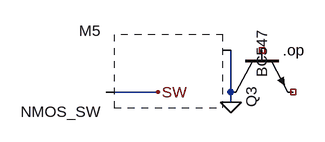
[diagram p0: schematic case_11.asc]
case_11.asc, the LTspice schematic file:
Version 4.1
SHEET 1 880 680
WIRE 256 400 336 400
WIRE 448 336 448 416
FLAG 336 400 SW
FLAG 448 416 0
SYMBOL Semiconductors\nmos 256 400 M0
SYMATTR InstName M5
SYMATTR Value NMOS_SW
SYMATTR SpiceLine m=3
SYMBOL npn 448 336 M90
WINDOW 3 -32 48 Left 2
SYMATTR InstName Q3
SYMATTR Value BC547
SYMATTR Type npn
TEXT 528 336 Left 2 !.op

The netlist it stands for:
* case_11.asc
* M5: NMOS_SW m=3 (symbol Semiconductors\nmos not available, pin order unknown); nets seen at it: 0, SW
Q3 0 NC_01 NC_02 0 BC547
.model NPN NPN
.model PNP PNP
.lib standard.bjt
.op
.backanno
.end